# Altium project RTM_SFP.PrjPcb (part 1 of 2)
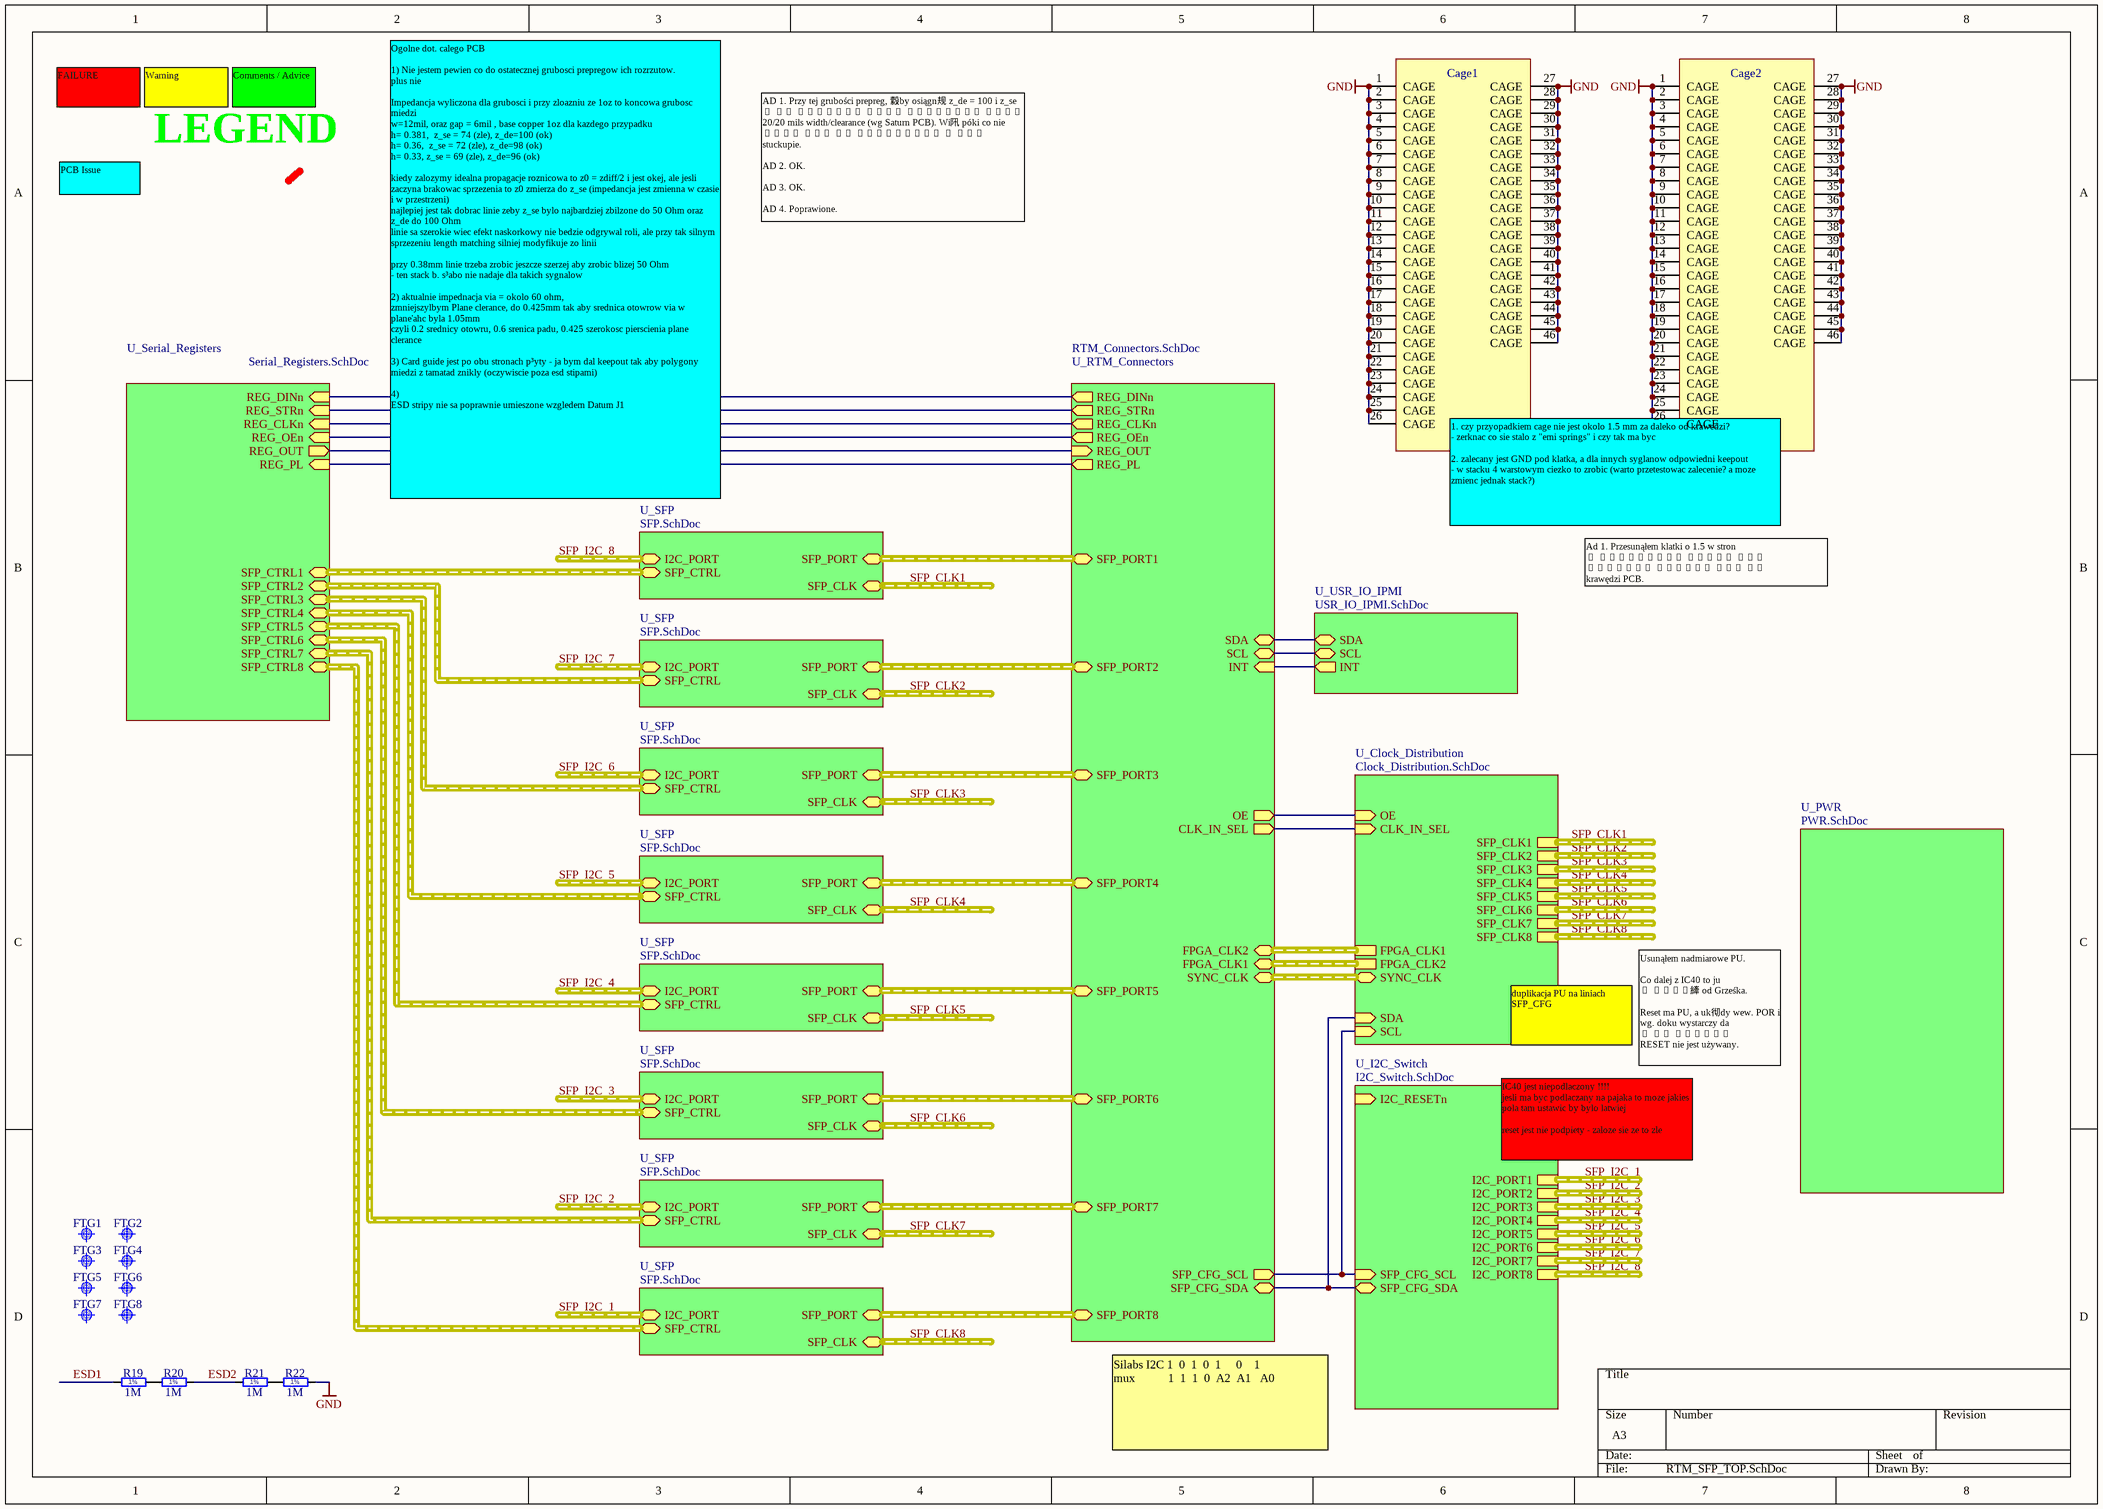
[diagram p0: RTM_SFP_TOP.SchDoc]
8 sheets, 363 parts. Net scope: hierarchical (ports join the sheet entries above them; power ports are global).
Board file: RTM_SFP.PcbDoc
Sheets:
  RTM_SFP_TOP.SchDoc
    U_SFP = SFP.SchDoc
    U_I2C_Switch = I2C_Switch.SchDoc
    U_Clock_Distribution = Clock_Distribution.SchDoc
    U_Serial_Registers = Serial_Registers.SchDoc
    U_SFP = SFP.SchDoc
    U_SFP = SFP.SchDoc
    U_SFP = SFP.SchDoc
    U_SFP = SFP.SchDoc
    U_SFP = SFP.SchDoc
    U_SFP = SFP.SchDoc
    U_SFP = SFP.SchDoc
    U_RTM_Connectors = RTM_Connectors.SchDoc
    U_USR_IO_IPMI = USR_IO_IPMI.SchDoc
    U_PWR = PWR.SchDoc

## Sheet RTM_SFP_TOP.SchDoc
size A3

### Parts
Cage1  SFP+  [TYCO_2007132-1]
Cage2  SFP+  [TYCO_2007132-1]
FTG1  Use only in PCB  [FIDUCIAL_TOP_S100-200]  (value not drawn)
FTG2  Use only in PCB  [FIDUCIAL_TOP_C100-200]  (value not drawn)
FTG3  Use only in PCB  [FIDUCIAL_TOP_S100-200]  (value not drawn)
FTG4  Use only in PCB  [FIDUCIAL_TOP_C100-200]  (value not drawn)
FTG5  Use only in PCB  [FIDUCIAL_TOP_S100-200]  (value not drawn)
FTG6  Use only in PCB  [FIDUCIAL_TOP_C100-200]  (value not drawn)
FTG7  Use only in PCB  [FIDUCIAL_TOP_S100-200]  (value not drawn)
FTG8  Use only in PCB  [FIDUCIAL_TOP_C100-200]  (value not drawn)
R19  1M  [RESC3216X65N]
R20  1M  [RESC3216X65N]
R21  1M  [RESC3216X65N]
R22  1M  [RESC3216X65N]

### Sub-sheets
U_Clock_Distribution = Clock_Distribution.SchDoc: SDA (in), SCL (in), OE (in), CLK_IN_SEL (in), FPGA_CLK1 (harness CLOCK_DIFF), FPGA_CLK2 (harness CLOCK_DIFF), SFP_CLK2 (harness CLOCK_DIFF), SFP_CLK3 (harness CLOCK_DIFF), SFP_CLK4 (harness CLOCK_DIFF), SFP_CLK5 (harness CLOCK_DIFF), SFP_CLK6 (harness CLOCK_DIFF), SFP_CLK7 (harness CLOCK_DIFF), SFP_CLK8 (harness CLOCK_DIFF), SFP_CLK1 (harness CLOCK_DIFF), SYNC_CLK (harness CLOCK_DIFF)
U_I2C_Switch = I2C_Switch.SchDoc: I2C_RESETn (in), I2C_PORT5 (harness I2C), I2C_PORT2 (harness I2C), I2C_PORT1 (harness I2C), I2C_PORT4 (harness I2C), I2C_PORT3 (harness I2C), I2C_PORT7 (harness I2C), I2C_PORT6 (harness I2C), I2C_PORT8 (harness I2C), SFP_CFG_SDA (bidir), SFP_CFG_SCL (in)
U_PWR = PWR.SchDoc: no entries
U_RTM_Connectors = RTM_Connectors.SchDoc: SFP_PORT8 (harness SFP_PORT), SFP_PORT7 (harness SFP_PORT), SFP_PORT6 (harness SFP_PORT), SFP_PORT5 (harness SFP_PORT), SFP_PORT4 (harness SFP_PORT), SFP_PORT3 (harness SFP_PORT), SFP_PORT2 (harness SFP_PORT), SFP_PORT1 (harness SFP_PORT), REG_DINn (out), REG_STRn (out), REG_CLKn (out), REG_OEn (out), REG_OUT (in), SFP_CFG_SDA (bidir), SFP_CFG_SCL (out), SDA (bidir), SCL (bidir), INT (in), FPGA_CLK2 (harness CLOCK_DIFF), FPGA_CLK1 (harness CLOCK_DIFF), SYNC_CLK (harness CLOCK_DIFF), OE (out), CLK_IN_SEL (out), REG_PL (out)
U_Serial_Registers = Serial_Registers.SchDoc: SFP_CTRL1 (harness SFP_CTRL), SFP_CTRL2 (harness SFP_CTRL), SFP_CTRL3 (harness SFP_CTRL), SFP_CTRL4 (harness SFP_CTRL), SFP_CTRL5 (harness SFP_CTRL), SFP_CTRL6 (harness SFP_CTRL), SFP_CTRL7 (harness SFP_CTRL), SFP_CTRL8 (harness SFP_CTRL), REG_DINn (in), REG_STRn (in), REG_CLKn (in), REG_OEn (in), REG_OUT (out), REG_PL (in)
U_SFP = SFP.SchDoc: I2C_PORT (harness I2C), SFP_CLK (harness CLOCK_DIFF), SFP_PORT (harness SFP_PORT), SFP_CTRL (harness SFP_CTRL)
U_SFP = SFP.SchDoc: I2C_PORT (harness I2C), SFP_CLK (harness CLOCK_DIFF), SFP_PORT (harness SFP_PORT), SFP_CTRL (harness SFP_CTRL)
U_SFP = SFP.SchDoc: I2C_PORT (harness I2C), SFP_CLK (harness CLOCK_DIFF), SFP_PORT (harness SFP_PORT), SFP_CTRL (harness SFP_CTRL)
U_SFP = SFP.SchDoc: I2C_PORT (harness I2C), SFP_CLK (harness CLOCK_DIFF), SFP_PORT (harness SFP_PORT), SFP_CTRL (harness SFP_CTRL)
U_SFP = SFP.SchDoc: I2C_PORT (harness I2C), SFP_CLK (harness CLOCK_DIFF), SFP_PORT (harness SFP_PORT), SFP_CTRL (harness SFP_CTRL)
U_SFP = SFP.SchDoc: I2C_PORT (harness I2C), SFP_CLK (harness CLOCK_DIFF), SFP_PORT (harness SFP_PORT), SFP_CTRL (harness SFP_CTRL)
U_SFP = SFP.SchDoc: I2C_PORT (harness I2C), SFP_CLK (harness CLOCK_DIFF), SFP_PORT (harness SFP_PORT), SFP_CTRL (harness SFP_CTRL)
U_SFP = SFP.SchDoc: I2C_PORT (harness I2C), SFP_CLK (harness CLOCK_DIFF), SFP_PORT (harness SFP_PORT), SFP_CTRL (harness SFP_CTRL)
U_USR_IO_IPMI = USR_IO_IPMI.SchDoc: SDA (bidir), SCL (bidir), INT (out)

### Nets
GND: Cage1.1(CAGE) Cage1.2(CAGE) Cage1.3(CAGE) Cage1.4(CAGE) Cage1.5(CAGE) Cage1.6(CAGE) Cage1.7(CAGE) Cage1.8(CAGE) Cage1.9(CAGE) Cage1.10(CAGE) Cage1.11(CAGE) Cage1.12(CAGE) Cage1.13(CAGE) Cage1.14(CAGE) Cage1.15(CAGE) Cage1.16(CAGE) Cage1.17(CAGE) Cage1.18(CAGE) Cage1.19(CAGE) Cage1.20(CAGE) Cage1.21(CAGE) Cage1.22(CAGE) Cage1.23(CAGE) Cage1.24(CAGE) Cage1.25(CAGE) Cage1.26(CAGE) Cage1.27(CAGE) Cage1.28(CAGE) Cage1.29(CAGE) Cage1.30(CAGE) Cage1.31(CAGE) Cage1.32(CAGE) Cage1.33(CAGE) Cage1.34(CAGE) Cage1.35(CAGE) Cage1.36(CAGE) Cage1.37(CAGE) Cage1.38(CAGE) Cage1.39(CAGE) Cage1.40(CAGE) Cage1.41(CAGE) Cage1.42(CAGE) Cage1.43(CAGE) Cage1.44(CAGE) Cage1.45(CAGE) Cage1.46(CAGE) Cage2.1(CAGE) Cage2.2(CAGE) Cage2.3(CAGE) Cage2.4(CAGE) Cage2.5(CAGE) Cage2.6(CAGE) Cage2.7(CAGE) Cage2.8(CAGE) Cage2.9(CAGE) Cage2.10(CAGE) Cage2.11(CAGE) Cage2.12(CAGE) Cage2.13(CAGE) Cage2.14(CAGE) Cage2.15(CAGE) Cage2.16(CAGE) Cage2.17(CAGE) Cage2.18(CAGE) Cage2.19(CAGE) Cage2.20(CAGE) Cage2.21(CAGE) Cage2.22(CAGE) Cage2.23(CAGE) Cage2.24(CAGE) Cage2.25(CAGE) Cage2.26(CAGE) Cage2.27(CAGE) Cage2.28(CAGE) Cage2.29(CAGE) Cage2.30(CAGE) Cage2.31(CAGE) Cage2.32(CAGE) Cage2.33(CAGE) Cage2.34(CAGE) Cage2.35(CAGE) Cage2.36(CAGE) Cage2.37(CAGE) Cage2.38(CAGE) Cage2.39(CAGE) Cage2.40(CAGE) Cage2.41(CAGE) Cage2.42(CAGE) Cage2.43(CAGE) Cage2.44(CAGE) Cage2.45(CAGE) Cage2.46(CAGE) R22.2
ESD1: R19.1
ESD2: R20.2 R21.1
RTM_IO0: sheet U_RTM_Connectors/INT, sheet U_USR_IO_IPMI/INT
RTM_IO1: sheet U_Serial_Registers/REG_OUT, sheet U_RTM_Connectors/REG_OUT
RTM_IO2: sheet U_Serial_Registers/REG_OEn, sheet U_RTM_Connectors/REG_OEn
RTM_IO3: sheet U_Serial_Registers/REG_CLKn, sheet U_RTM_Connectors/REG_CLKn
RTM_IO4: sheet U_Serial_Registers/REG_STRn, sheet U_RTM_Connectors/REG_STRn
RTM_IO5: sheet U_Serial_Registers/REG_DINn, sheet U_RTM_Connectors/REG_DINn
RTM_IO6: sheet U_Serial_Registers/REG_PL, sheet U_RTM_Connectors/REG_PL
RTM_IO8: sheet U_Clock_Distribution/CLK_IN_SEL, sheet U_RTM_Connectors/CLK_IN_SEL
RTM_IO9: sheet U_Clock_Distribution/OE, sheet U_RTM_Connectors/OE
RTM_IO10: sheet U_I2C_Switch/SFP_CFG_SCL, sheet U_Clock_Distribution/SCL, sheet U_RTM_Connectors/SFP_CFG_SCL
RTM_IO11: sheet U_I2C_Switch/SFP_CFG_SDA, sheet U_Clock_Distribution/SDA, sheet U_RTM_Connectors/SFP_CFG_SDA
NetIC12_1: sheet U_RTM_Connectors/SDA, sheet U_USR_IO_IPMI/SDA
NetIC12_2: sheet U_RTM_Connectors/SCL, sheet U_USR_IO_IPMI/SCL
NetR19_2: R19.2 R20.1
NetR21_2: R21.2 R22.1

### Buses and harness runs
harness SFP_CLK1 = sheet U_Clock_Distribution/SFP_CLK1
harness SFP_CLK1 = sheet U_SFP/SFP_CLK
harness SFP_CLK2 = sheet U_Clock_Distribution/SFP_CLK2
harness SFP_CLK2 = sheet U_SFP/SFP_CLK
harness SFP_CLK3 = sheet U_Clock_Distribution/SFP_CLK3
harness SFP_CLK3 = sheet U_SFP/SFP_CLK
harness SFP_CLK4 = sheet U_Clock_Distribution/SFP_CLK4
harness SFP_CLK4 = sheet U_SFP/SFP_CLK
harness SFP_CLK5 = sheet U_Clock_Distribution/SFP_CLK5
harness SFP_CLK5 = sheet U_SFP/SFP_CLK
harness SFP_CLK6 = sheet U_Clock_Distribution/SFP_CLK6
harness SFP_CLK6 = sheet U_SFP/SFP_CLK
harness SFP_CLK7 = sheet U_Clock_Distribution/SFP_CLK7
harness SFP_CLK7 = sheet U_SFP/SFP_CLK
harness SFP_CLK8 = sheet U_Clock_Distribution/SFP_CLK8
harness SFP_CLK8 = sheet U_SFP/SFP_CLK
harness SFP_I2C_1 = sheet U_I2C_Switch/I2C_PORT1
harness SFP_I2C_1 = sheet U_SFP/I2C_PORT
harness SFP_I2C_2 = sheet U_I2C_Switch/I2C_PORT2
harness SFP_I2C_2 = sheet U_SFP/I2C_PORT
harness SFP_I2C_3 = sheet U_I2C_Switch/I2C_PORT3
harness SFP_I2C_3 = sheet U_SFP/I2C_PORT
harness SFP_I2C_4 = sheet U_I2C_Switch/I2C_PORT4
harness SFP_I2C_4 = sheet U_SFP/I2C_PORT
harness SFP_I2C_5 = sheet U_I2C_Switch/I2C_PORT5
harness SFP_I2C_5 = sheet U_SFP/I2C_PORT
harness SFP_I2C_6 = sheet U_I2C_Switch/I2C_PORT6
harness SFP_I2C_6 = sheet U_SFP/I2C_PORT
harness SFP_I2C_7 = sheet U_I2C_Switch/I2C_PORT7
harness SFP_I2C_7 = sheet U_SFP/I2C_PORT
harness SFP_I2C_8 = sheet U_I2C_Switch/I2C_PORT8
harness SFP_I2C_8 = sheet U_SFP/I2C_PORT
harness sheet U_Clock_Distribution/FPGA_CLK1 = sheet U_RTM_Connectors/FPGA_CLK2
harness sheet U_Clock_Distribution/FPGA_CLK2 = sheet U_RTM_Connectors/FPGA_CLK1
harness sheet U_Clock_Distribution/SYNC_CLK = sheet U_RTM_Connectors/SYNC_CLK
harness sheet U_RTM_Connectors/SFP_PORT1 = sheet U_SFP/SFP_PORT
harness sheet U_RTM_Connectors/SFP_PORT2 = sheet U_SFP/SFP_PORT
harness sheet U_RTM_Connectors/SFP_PORT3 = sheet U_SFP/SFP_PORT
harness sheet U_RTM_Connectors/SFP_PORT4 = sheet U_SFP/SFP_PORT
harness sheet U_RTM_Connectors/SFP_PORT5 = sheet U_SFP/SFP_PORT
harness sheet U_RTM_Connectors/SFP_PORT6 = sheet U_SFP/SFP_PORT
harness sheet U_RTM_Connectors/SFP_PORT7 = sheet U_SFP/SFP_PORT
harness sheet U_RTM_Connectors/SFP_PORT8 = sheet U_SFP/SFP_PORT
harness sheet U_Serial_Registers/SFP_CTRL1 = sheet U_SFP/SFP_CTRL
harness sheet U_Serial_Registers/SFP_CTRL2 = sheet U_SFP/SFP_CTRL
harness sheet U_Serial_Registers/SFP_CTRL3 = sheet U_SFP/SFP_CTRL
harness sheet U_Serial_Registers/SFP_CTRL4 = sheet U_SFP/SFP_CTRL
harness sheet U_Serial_Registers/SFP_CTRL5 = sheet U_SFP/SFP_CTRL
harness sheet U_Serial_Registers/SFP_CTRL6 = sheet U_SFP/SFP_CTRL
harness sheet U_Serial_Registers/SFP_CTRL7 = sheet U_SFP/SFP_CTRL
harness sheet U_Serial_Registers/SFP_CTRL8 = sheet U_SFP/SFP_CTRL

### Notes on the sheet
- FAILURE
- Warning
- Comments / Advice
- PCB Issue
- AD 1. Przy tej grubości prepreg, 縠by osi筭n规 z_de = 100 i z_se = 50 routing diff musiałby mie� 20/20 mils width/clearance (wg Saturn PCB). Wi阠 póki co nie wiem jak to rozwi箊a� w tym stuckupie.
  AD 2. OK.
  AD 3. OK.
  AD 4. Poprawione.
- Ogolne dot. calego PCB
  1) Nie jestem pewien co do ostatecznej grubosci prepregow ich rozrzutow.
  plus nie
  Impedancja wyliczona dla grubosci i przy zloazniu ze 1oz to koncowa grubosc miedzi
  w=12mil, oraz gap = 6mil , base copper 1oz dla kazdego przypadku
  h= 0.381,  z_se = 74 (zle), z_de=100 (ok)
  h= 0.36,  z_se = 72 (zle), z_de=98 (ok)
  h= 0.33, z_se = 69 (zle), z_de=96 (ok)
  kiedy zalozymy idealna propagacje roznicowa to z0 = zdiff/2 i jest okej, ale jesli zaczyna brakowac sprzezenia to z0 zmierza do z_se (impedancja jest zmienna w czasie i w przestrzeni)
  najlepiej jest tak dobrac linie zeby z_se bylo najbardziej zbilzone do 50 Ohm oraz z_de do 100 Ohm
  linie sa szerokie wiec efekt naskorkowy nie bedzie odgrywal roli, ale przy tak silnym sprzezeniu length matching silniej modyfikuje zo linii
  przy 0.38mm linie trzeba zrobic jeszcze szerzej aby zrobic blizej 50 Ohm
  - ten stack b. s³abo nie nadaje dla takich sygnalow
  2) aktualnie impednacja via = okolo 60 ohm,
  zmniejszylbym Plane clerance, do 0.425mm tak aby srednica otowrow via w plane'ahc byla 1.05mm
  czyli 0.2 srednicy otowru, 0.6 srenica padu, 0.425 szerokosc pierscienia plane clerance
  3) Card guide jest po obu stronach p³yty - ja bym dal keepout tak aby polygony miedzi z tamatad znikly (oczywiscie poza esd stipami)
  4)
  ESD stripy nie sa poprawnie umieszone wzgledem Datum J1
- 1. czy przyopadkiem cage nie jest okolo 1.5 mm za daleko od krawedzi?
  - zerknac co sie stalo z "emi springs" i czy tak ma byc
  2. zalecany jest GND pod klatka, a dla innych syglanow odpowiedni keepout
  - w stacku 4 warstowym ciezko to zrobic (warto przetestowac zalecenie? a moze zmienc jednak stack?)
- Ad 1. Przesunąłem klatki o 1.5 w stron� krawędzi. Teraz emi springs ko馽z� si� na krawędzi PCB.
- duplikacja PU na liniach SFP_CFG
- Usunąłem nadmiarowe PU.
  Co dalej z IC40 to ju� zale縴 od Grześka.
  Reset ma PU, a uk彻dy wew. POR i wg. doku wystarczy da� PU jeżeli RESET nie jest używany.
- IC40 jest niepodlaczony !!!!
  jesli ma byc podlaczany na pajaka to moze jakies pola tam ustawic by bylo latwiej
  reset jest nie podpiety - zaloze sie ze to zle
- Silabs I2C 1  0  1  0  1     0    1
  mux           1  1  1  0  A2  A1   A0
- Labels drawn without touching a wire or pin: LEGEND
- (in symbol R1206_1M_1%_0.25W_100PPM) 1%

### Library data of the parts
Cage1 Cage2 = TYCO_2007132-1: SFP+  1x4 Cage (46 Pins); Part Description: 1x4 Press Fit Cage For Use with SFP+ Connector (Small Form-factor Pluggable); Manufacturer: TYCO ELECTRONICS; Table: TYCO; Part Number: TYCO_2007132-1; Component Kind: Standard; Component Type: Standard; Pin Count: 46; Family: SFP+; Mounted: Yes; Socket: No; SMD: No; Status: None; Manufacturer Part Number: 2007132-1; ComponentHeight: 9.7mm; HelpURL: \\cern.ch\dfs\Applications\Altium\Datasheets\TYCO_2007132-1.pdf; Author: CERN DEM JLC; CreateDate: 2013-06-04; LatestRevisionDate: 2013-06-12
FTG1 FTG3 FTG5 FTG7 = FIDUCIAL_TARGET_S100-200: Fiducial Target; Part Description: Square Fiducial Target, Top Layer, 1.0mm, Top Solder 2.0mm, Keepout =2.0mm; Mounted: No; Table: Pads; Part Number: FIDUCIAL_TARGET_S100-200; Component Kind: Standard (No BOM); Component Type: Standard (No BOM); Pin Count: 1; Family: Fiducial; Socket: No; SMD: Yes; Status: None; ComponentHeight: 0mm; Author: CERN DEM JLC; CreateDate: 2010-02-09; LatestRevisionDate: 2012-04-04; PackageDescription: Square Fiducial Target, Top Layer, 1.0mm, Top Solder 2.0mm, Keepout =2.0mm
FTG2 FTG4 FTG6 FTG8 = FIDUCIAL_TARGET_C100-200: Fiducial Target; Part Description: Round Fiducial Target, Top Layer, 1.0mm, Top Solder 2.0mm, Keepout =2.0mm; Mounted: No; Table: Pads; Part Number: FIDUCIAL_TARGET_C100-200; Component Kind: Standard (No BOM); Component Type: Standard (No BOM); Pin Count: 1; Family: Fiducial; Socket: No; SMD: Yes; Status: None; ComponentHeight: 0mm; Author: CERN DEM JLC; CreateDate: 2010-02-09; LatestRevisionDate: 2012-04-04; PackageDescription: Round Fiducial Target, Top Layer, 1.0mm, Top Solder 2.0mm, Keepout =2.0mm
R19-R22 = R1206_1M_1%_0.25W_100PPM: Resistor - 1%; Part Description: General Purpose Thick Film Chip Resistor; Manufacturer: GENERIC; Manufacturer1 Part Number: NRC12F1004TRF; Power: 0.25W; TC: ±100ppm/°C; Table: Resistors SMD; Part Number: R1206_1M_1%_0.25W_100PPM; Component Kind: Standard; Component Type: Standard; Pin Count: 2; Value: 1M; Status: Preferred; Tolerance: ±1%; Manufacturer Part Number: R1206_1M_1%_0.25W_100PPM; Case: 1206; Mounted: Yes; Socket: No; SMD: Yes; Manufacturer1 Example: NIC COMPONENT; Manufacturer1 ComponentHeight: 0.65mm; HelpURL: \\cern.ch\dfs\Applications\Altium\Datasheets\R1206_NIC_NRC.pdf; Author: CERN DEM JLC; CreateDate: 2007-12-03; LatestRevisionDate: 2008-03-13

## Sheet SFP.SchDoc
size A4; Organization: Altium Limited; Address1: L3, 12a Rodborough Rd; Address2: Frenchs Forest; Address3: NSW; Address4: Australia 2086
Used 8 times, as channels U_SFP, U_SFP, U_SFP, U_SFP, U_SFP, U_SFP, U_SFP, U_SFP. Parts and nets are listed once, with the designators drawn on the sheet.
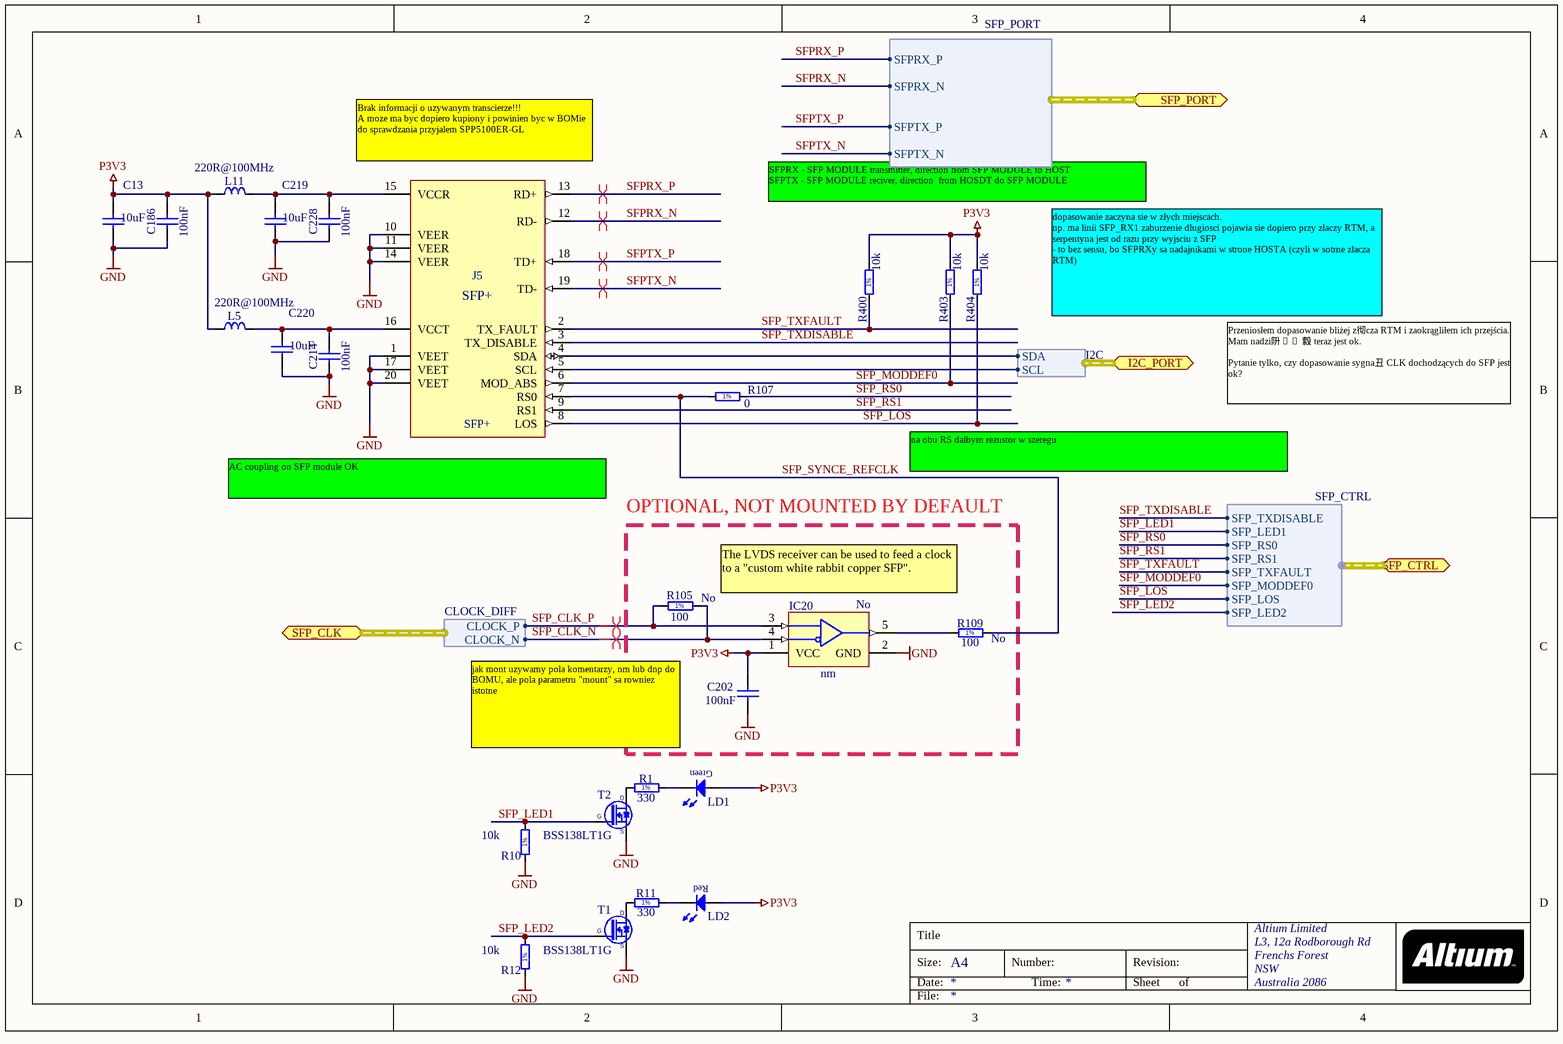
[diagram p1: SFP.SchDoc]

### Parts
C13  10uF  [CAPC2012X135N]
C186  100nF  [CAPC1005X55N]
C202  100nF  [CAPC1005X55N]
C214  100nF  [CAPC1005X55N]
C219  10uF  [CAPC2012X135N]
C220  10uF  [CAPC2012X135N]
C228  100nF  [CAPC1005X55N]
IC20  nm  Mounted: No  [SOT95P280X145-5N]
J5  SFP+  [TYCO_1888247-1]
L5  220R@100MHz  [INDC2012X105N]
L11  220R@100MHz  [INDC2012X105N]
LD1  Green  [LED_AVAGO_HSME-C120]  (value not drawn)
LD2  Red  [LED_AVAGO_HSME-C120]  (value not drawn)
R1  330  [RESC1608X55N]
R10  10k  [RESC1608X55N]
R11  330  [RESC1608X55N]
R12  10k  [RESC1608X55N]
R105  100  Mounted: No  [RESC1608X55N]
R107  0  [RESC1608X55N]
R109  100  Mounted: No  [RESC1608X55N]
R400  10k  [RESC1608X55N]
R403  10k  [RESC1608X55N]
R404  10k  [RESC1608X55N]
T1  BSS138LT1G  [SOT95P240X110-3N]
T2  BSS138LT1G  [SOT95P240X110-3N]

### Blocks framed on the sheet
OPTIONAL, NOT MOUNTED BY DEFAULT: C202 IC20 R105 R109

### Ports
I2C_PORT (harness I2C), SFP_CLK (harness CLOCK_DIFF), SFP_CTRL (harness SFP_CTRL), SFP_PORT (harness SFP_PORT)

### Harnesses
I2C: SCL, SDA
CLOCK_DIFF: CLOCK_P, CLOCK_N
SFP_PORT: SFPRX_P, SFPRX_N, SFPTX_P, SFPTX_N
SFP_CTRL: SFP_LED1, SFP_TXFAULT, SFP_TXDISABLE, SFP_MODDEF0, SFP_RS0, SFP_RS1, SFP_LOS, SFP_LED2

### Nets
GND: C13.2 C186.2 C202.1 C214.2 C219.2 C220.2 C228.2 IC20.2(GND) J5.1(VEET) J5.10(VEER) J5.11(VEER) J5.14(VEER) J5.17(VEET) J5.20(VEET) R10.1 R12.1 T1.2(S) T2.2(S)
P3V3: C13.1 C186.1 C202.2 IC20.1(VCC) L5.1 L11.1 LD1.1(A) LD2.1(A) R400.2 R403.2 R404.2
SFP_CLK_N: IC20.4(B) R105.2 ; port SFP_CLK.CLOCK_N
SFP_CLK_P: IC20.3(A) R105.1 ; port SFP_CLK.CLOCK_P
SFP_LED1: R10.2 T2.1(G) ; port SFP_CTRL.SFP_LED1
SFP_LED2: R12.2 T1.1(G) ; port SFP_CTRL.SFP_LED2
SFP_LOS: J5.8(LOS) R404.1 ; port SFP_CTRL.SFP_LOS
SFP_MODDEF0: J5.6(MOD_ABS) R403.1 ; port SFP_CTRL.SFP_MODDEF0
SFP_RS0: R107.2 ; port SFP_CTRL.SFP_RS0
SFP_RS1: J5.9(RS1) ; port SFP_CTRL.SFP_RS1
SFP_SYNCE_REFCLK: J5.7(RS0) R107.1 R109.2
SFP_TXDISABLE: J5.3(TX_DISABLE) ; port SFP_CTRL.SFP_TXDISABLE
SFP_TXFAULT: J5.2(TX_FAULT) R400.1 ; port SFP_CTRL.SFP_TXFAULT
SFPRX_N: J5.12(RD-) ; port SFP_PORT.SFPRX_N
SFPRX_P: J5.13(RD+) ; port SFP_PORT.SFPRX_P
SFPTX_N: J5.19(TD-) ; port SFP_PORT.SFPTX_N
SFPTX_P: J5.18(TD+) ; port SFP_PORT.SFPTX_P
NetC214_1: C214.1 C220.1 J5.16(VCCT) L5.2
NetC219_1: C219.1 C228.1 J5.15(VCCR) L11.2
NetIC20_5: IC20.5(R) R109.1
NetJ5_4: J5.4(SDA) ; port I2C_PORT.SDA
NetJ5_5: J5.5(SCL) ; port I2C_PORT.SCL
NetLD1_2: LD1.2(C) R1.2
NetLD2_2: LD2.2(C) R11.2
NetR1_1: R1.1 T2.3(D)
NetR11_1: R11.1 T1.3(D)

### Channels
U_SFP: designators end in A
U_SFP: designators end in B
U_SFP: designators end in C
U_SFP: designators end in D
U_SFP: designators end in E
U_SFP: designators end in F
U_SFP: designators end in G
U_SFP: designators end in H

### Layout directives
differential pair: SFP1RX_N, SFP1RX_P, SFP1TX_N, SFP1TX_P, SFP_CLK1.CLOCK_N, SFP_CLK1.CLOCK_P

### Notes on the sheet
- (near J5) Brak informacji o uzywanym transcierze!!!
  A moze ma byc dopiero kupiony i powinien byc w BOMie
  do sprawdzania przyjalem SPP5100ER-GL
- SFPRX - SFP MODULE transmitter, direction from SFP MODULE to HOST
  SFPTX - SFP MODULE reciver, direction  from HOSDT do SFP MODULE
- dopasowanie zaczyna sie w zlych miejscach.
  np. ma linii SFP_RX1 zaburzenie dlugiosci pojawia sie dopiero przy zlaczy RTM, a serpentyna jest od razu przy wyjsciu z SFP
  - to bez sensu, bo SFPRXy sa nadajnikami w strone HOSTA (czyli w sotrne zlacza RTM)
- Przeniosłem dopasowanie bliżej z彻cza RTM i zaokrągliłem ich przejścia. Mam nadzi阩�, 縠 teraz jest ok.
  Pytanie tylko, czy dopasowanie sygna丑 CLK dochodzących do SFP jest ok?
- (near J5) AC coupling on SFP module OK
- na obu RS dalbym rezustor w szeregu
- The LVDS receiver can be used to feed a clock to a "custom white rabbit copper SFP".
- jak mont uzywamy pola komentarzy, nm lub dnp do BOMU, ale pola parametru "mount" sa rowniez istotne
- Title
- Size:
- Date:
- A4
- Number:
- Time:
- Revision:
- Sheet
- of
- File:
- (in symbol R0603_0R_JUMPER) 1%
- (in symbol R0603_10K_1%_0.1W_100PPM) 1%
- (in symbol R0603_100R_1%_0.1W_100PPM) 1%
- (in symbol R0603_330R_1%_0.1W_100PPM) 1%

### Library data of the parts
C13 C219 C220 = CC0805_10UF_10V_10%_X7R: Non-polarised capacitor; Part Description: SMD Multilayer Chip Ceramic Capacitor; Manufacturer: GENERIC; Manufacturer1 Part Number: GRM21BR71A106KE51L; Voltage: 10V; TC: X7R; Tolerance: ±10%; Table: Capacitors SMD; Part Number: CC0805_10UF_10V_10%_X7R; Component Kind: Standard; Component Type: Standard; Pin Count: 2; Value: 10uF; Status: Preferred; Manufacturer Part Number: CC0805_10UF_10V_10%_X7R; Case: 0805; Mounted: Yes; Socket: No; SMD: Yes; Manufacturer1 Example: MURATA; Manufacturer1 ComponentHeight: 1.35mm; HelpURL: \\cern.ch\dfs\Applications\Altium\Datasheets\CC0805_X7R_MURATA.pdf; Author: CERN DEM JLC; CreateDate: 2012-04-30; LatestRevisionDate: 2012-04-30
C186 C214 C228 = CC0402_100NF_16V_10%_X7R: Non-polarised capacitor; Part Description: SMD Multilayer Chip Ceramic Capacitor; Manufacturer: GENERIC; Manufacturer1 Part Number: 223878715649; Voltage: 16V; TC: X7R; Tolerance: ±10%; Table: Capacitors SMD; Part Number: CC0402_100NF_16V_10%_X7R; Component Kind: Standard; Component Type: Standard; Pin Count: 2; Value: 100nF; Status: Not Recommended; Manufacturer Part Number: CC0402_100NF_16V_10%_X7R; Case: 0402; Mounted: Yes; Socket: No; SMD: Yes; Manufacturer1 Example: PHYCOMP; Manufacturer1 ComponentHeight: 0.55mm; HelpURL: \\cern.ch\dfs\Applications\Altium\Datasheets\CC0402_X7R_PHYCOMP.pdf; Author: CERN DEM JLC; CreateDate: 12/3/2007; LatestRevisionDate: 12/3/2007
C202 = CC0402_100NF_16V_10%_X7R: Non-polarised capacitor; Part Description: SMD Multilayer Chip Ceramic Capacitor; Manufacturer: GENERIC; Manufacturer1 Part Number: 223878715649; Voltage: 16V; TC: X7R; Tolerance: ±10%; Mounted: No; Table: Capacitors SMD; Part Number: CC0402_100NF_16V_10%_X7R; Component Kind: Standard; Component Type: Standard; Pin Count: 2; Value: 100nF; Status: Not Recommended; Manufacturer Part Number: CC0402_100NF_16V_10%_X7R; Case: 0402; Socket: No; SMD: Yes; Manufacturer1 Example: PHYCOMP; Manufacturer1 ComponentHeight: 0.55mm; HelpURL: \\cern.ch\dfs\Applications\Altium\Datasheets\CC0402_X7R_PHYCOMP.pdf; Author: CERN DEM JLC; CreateDate: 2007-12-03; LatestRevisionDate: 2007-12-03
IC20 = SN65LVDS2DBVR: High-Speed Differential Line Receiver; Manufacturer: TEXAS INSTRUMENTS; Table: Analog & Interface; Part Number: SN65LVDS2DBVR; Component Kind: Standard; Component Type: Standard; Device: SN65LVDS2DBVR; PackageDescription: SOT, 0.95mm pitch; 5 pin, 1.60mm W X 2.90mm L X 1.45mm H body, IPC Medium Density; Part Description: High-Speed Differential Line Receiver; Manufacturer Part Number: SN65LVDS2DBVR; Pin Count: 5; Case: SOT23-5; Socket: No; SMD: Yes; ComponentHeight: 1.45mm; Author: CERN DEM JLC; HelpURL: \\cern.ch\dfs\Applications\Altium\Datasheets\SN65LVDS2DBVR.pdf; CreateDate: 3/3/2011; LatestRevisionDate: 3/3/2011
J5 = TYCO_1888247-1: 20 Position SFP+ Connector (Small Form-factor Pluggable); Part Description: 20 Position, Pitch 0.8mm SFP+  Receptacle (Small Form-factor Pluggable); Manufacturer: TYCO ELECTRONICS; Table: TYCO; Part Number: TYCO_1888247-1; Component Kind: Standard; Component Type: Standard; Pin Count: 20; Family: SFP+; Mounted: Yes; Socket: No; SMD: Yes; Status: None; Manufacturer Part Number: 1888247-1; ComponentHeight: 5.4mm; HelpURL: \\cern.ch\dfs\Applications\Altium\Datasheets\TYCO_1888247-1.pdf; Author: CERN DEM JLC; CreateDate: 2012-02-27; LatestRevisionDate: 2012-02-27
L5 L11 = IND0805_MURATA_BLM21PG221SN1D: Inductor; Part Description: SMD EMIFIL Suppression Chip Ferrite Bead; Manufacturer: MURATA; Power: 2A; Resistance: 0.05R; Tolerance: ±25%; Table: Inductors SMD; Part Number: IND0805_MURATA_BLM21PG221SN1D; Component Kind: Standard; Component Type: Standard; Pin Count: 2; Value: 220R@100MHz; Status: None; Manufacturer Part Number: BLM21PG221SN1D; Case: 0805; Mounted: Yes; Socket: No; SMD: Yes; ComponentHeight: 1.05mm; HelpURL: \\cern.ch\dfs\Applications\Altium\Datasheets\IND0402_MURATA_BLM21P.pdf; Author: CERN DEM JLC; CreateDate: 25/01/2010; LatestRevisionDate: 25/01/2010
LD1 = LED_SMD_90deg_mini_G: LED Green Avago C120; Part Description: High Performance Right Angle Chip Green LED; Manufacturer: AVAGO TECHNOLOGIES; Manufacturer Part Number: HSME-C120; Table: LEDs & Displays; Part Number: LED_AVAGO_HSME-C120; Component Kind: Standard; Component Type: Standard; Color: Green; PackageDescription: Green Chip LED, 2-Leads, Body 1.7x1.1mm, Side Emitting Package; Pin Count: 2; Mounted: Yes; Socket: No; SMD: Yes; ComponentHeight: 0.7mm; HelpURL: \\cern.ch\dfs\Applications\Altium\Datasheets\LED_AVAGO_HSME-C120.pdf; ComponentLink1URL: \\cern.ch\dfs\Applications\Altium\Datasheets\LED_AVAGO_HSME-C110_DESIGN-GUIDE.pdf; ComponentLink1Description: Design Guide; Author: CERN DEM JMW; CreateDate: 2009-07-22; LatestRevisionDate: 2012-06-20
LD2 = LED_SMD_90deg_mini_R: LED Red Avago C120; Part Number: LED_AVAGO_HSMC-C120; Part Description: High Performance Right Angle Chip Red LED; Manufacturer: AVAGO TECHNOLOGIES; Manufacturer Part Number: HSMC-C120; Table: LEDs & Displays; Component Kind: Standard; Component Type: Standard; Color: Red; Footprint: LED_AVAGO_HSMC-C120; PackageDescription: Red Chip LED, 2-Leads, Body 1.7x1.1mm, Side Emitting Package; Pin Count: 2; Mounted: Yes; Socket: No; SMD: Yes; ComponentHeight: 0.7mm; HelpURL: \\cern.ch\dfs\Applications\Altium\Datasheets\LED_AVAGO_HSME-C120.pdf; ComponentLink1URL: \\cern.ch\dfs\Applications\Altium\Datasheets\LED_AVAGO_HSME-C110_DESIGN-GUIDE.pdf; ComponentLink1Description: Design Guide; Author: CERN DEM JMW; CreateDate: 2009-07-22; LatestRevisionDate: 2012-06-20
R1 R11 = R0603_330R_1%_0.1W_100PPM: Resistor - 1%; Part Description: General Purpose Thick Film Chip Resistor; Manufacturer: GENERIC; Manufacturer1 Part Number: NRC06F3300TRF; Power: 0.1W; TC: ±100ppm/°C; Table: Resistors SMD; Part Number: R0603_330R_1%_0.1W_100PPM; Component Kind: Standard; Component Type: Standard; Pin Count: 2; Value: 330; Status: Preferred; Tolerance: ±1%; Manufacturer Part Number: R0603_330R_1%_0.1W_100PPM; Case: 0603; Mounted: Yes; Socket: No; SMD: Yes; Manufacturer1 Example: NIC COMPONENT; Manufacturer1 ComponentHeight: 0.55mm; HelpURL: \\cern.ch\dfs\Applications\Altium\Datasheets\R0603_NIC_NRC.pdf; Author: CERN DEM JLC; CreateDate: 2007-12-03; LatestRevisionDate: 2008-03-13
R10 R12 R400 R403 R404 = R0603_10K_1%_0.1W_100PPM: Resistor - 1%; Part Description: General Purpose Thick Film Chip Resistor; Manufacturer: GENERIC; Manufacturer1 Part Number: NRC06F1002TRF; Power: 0.1W; TC: ±100ppm/°C; Table: Resistors SMD; Part Number: R0603_10K_1%_0.1W_100PPM; Component Kind: Standard; Component Type: Standard; Pin Count: 2; Value: 10k; Status: Preferred; Tolerance: ±1%; Manufacturer Part Number: R0603_10K_1%_0.1W_100PPM; Case: 0603; Mounted: Yes; Socket: No; SMD: Yes; Manufacturer1 Example: NIC COMPONENT; Manufacturer1 ComponentHeight: 0.55mm; HelpURL: \\cern.ch\dfs\Applications\Altium\Datasheets\R0603_NIC_NRC.pdf; Author: CERN DEM JLC; CreateDate: 12/3/2007; LatestRevisionDate: 3/13/2008
R105 R109 = R0603_100R_1%_0.1W_100PPM: Resistor - 1%; Part Description: General Purpose Thick Film Chip Resistor; Manufacturer: GENERIC; Manufacturer1 Part Number: NRC06F4700TRF; Power: 0.1W; TC: ±100ppm/°C; Table: Resistors SMD; Part Number: R0603_100R_1%_0.1W_100PPM; Component Kind: Standard; Component Type: Standard; Pin Count: 2; Value: 100; Status: Preferred; Tolerance: ±1%; Manufacturer Part Number: R0603_100R_1%_0.1W_100PPM; Case: 0603; Socket: No; SMD: Yes; Manufacturer1 Example: NIC COMPONENT; Manufacturer1 ComponentHeight: 0.55mm; HelpURL: \\cern.ch\dfs\Applications\Altium\Datasheets\R0603_NIC_NRC.pdf; Author: CERN DEM JLC; CreateDate: 12/3/2007; LatestRevisionDate: 3/13/2008
R107 = R0603_0R_JUMPER: Resistor - 1%; Part Description: 1A (0.05R Max DC Resistance) Zero Ohm Jumper; Manufacturer: GENERIC; Manufacturer1 Part Number: NRC06Z0; Table: Resistors SMD; Part Number: R0603_0R_JUMPER; Component Kind: Standard; Component Type: Standard; Pin Count: 2; Value: 0; Status: Preferred; Manufacturer Part Number: R0603_0R_JUMPER; Case: 0603; Mounted: Yes; Socket: No; SMD: Yes; Manufacturer1 Example: NIC COMPONENT; Manufacturer1 ComponentHeight: 0.55mm; HelpURL: \\cern.ch\dfs\Applications\Altium\Datasheets\R0603_NIC_NRC.pdf; Author: CERN DEM JLC; CreateDate: 12/3/2007; LatestRevisionDate: 3/13/2008
T1 T2 = BSS138LT1G: N-CHANNEL MOSFET WITH DIODE; Part Description: 50V 200mA N-Channel Enhancement Mode Field-Effect Transistor; Manufacturer: ON SEMICONDUCTOR; Table: Transistors; Part Number: BSS138LT1G; Component Kind: Standard; Component Type: Standard; Device: BSS138LT1G; PackageDescription: SOT23 3-Leads, Pitch 0.95mm - Body 1.4x3mm, IPC Medium Density; Manufacturer Part Number: BSS138LT1G; Pin Count: 3; Case: SOT23-3; Mounted: Yes; Socket: No; SMD: Yes; ComponentHeight: 1.11mm; HelpURL: \\cern.ch\dfs\Applications\Altium\Datasheets\BSS138LT1G.pdf; Author: CERN DEM JLC; CreateDate: 2009-03-23; LatestRevisionDate: 2009-03-23

## Sheet I2C_Switch.SchDoc
size A3; Organization: Altium Limited; Address1: L3, 12a Rodborough Rd; Address2: Frenchs Forest; Address3: NSW; Address4: Australia 2086
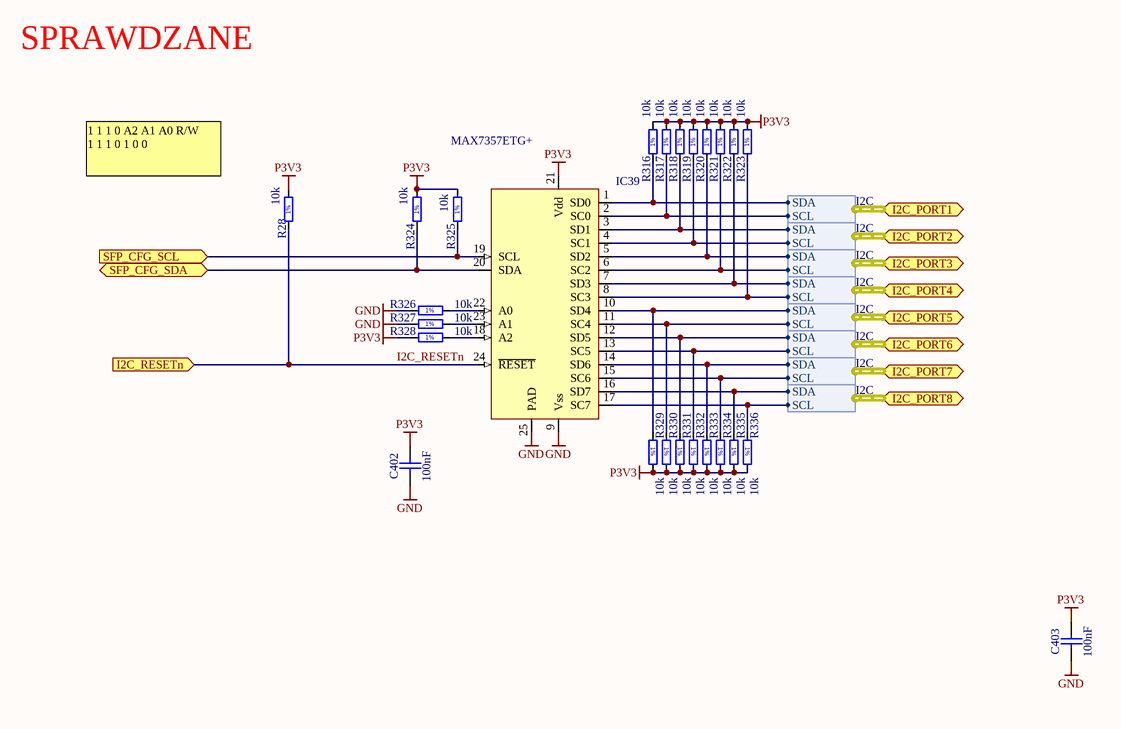
[diagram p2: I2C_Switch.SchDoc]

### Parts
C402  100nF  [CAPC0603X33N]
C403  100nF  [CAPC0603X33N]
IC39  MAX7357ETG+  [HVQFN24]
R28  10k  [RESC1005X40N]
R316  10k  [RESC1005X40N]
R317  10k  [RESC1005X40N]
R318  10k  [RESC1005X40N]
R319  10k  [RESC1005X40N]
R320  10k  [RESC1005X40N]
R321  10k  [RESC1005X40N]
R322  10k  [RESC1005X40N]
R323  10k  [RESC1005X40N]
R324  10k  [RESC1005X40N]
R325  10k  [RESC1005X40N]
R326  10k  [RESC1005X40N]
R327  10k  [RESC1005X40N]
R328  10k  [RESC1005X40N]
R329  10k  [RESC1005X40N]
R330  10k  [RESC1005X40N]
R331  10k  [RESC1005X40N]
R332  10k  [RESC1005X40N]
R333  10k  [RESC1005X40N]
R334  10k  [RESC1005X40N]
R335  10k  [RESC1005X40N]
R336  10k  [RESC1005X40N]

### Ports
I2C_PORT1 (harness I2C), I2C_PORT2 (harness I2C), I2C_PORT3 (harness I2C), I2C_PORT4 (harness I2C), I2C_PORT5 (harness I2C), I2C_PORT6 (harness I2C), I2C_PORT7 (harness I2C), I2C_PORT8 (harness I2C), I2C_RESETn (in), SFP_CFG_SCL (in), SFP_CFG_SDA (bidir)

### Harnesses
I2C: SCL, SDA

### Nets
GND: C402.1 C403.1 IC39.9(Vss) IC39.25(PAD) R326.1 R327.1
P3V3: C402.2 C403.2 IC39.21(Vdd) R28.2 R316.2 R317.2 R318.2 R319.2 R320.2 R321.2 R322.2 R323.2 R324.2 R325.2 R328.1 R329.2 R330.2 R331.2 R332.2 R333.2 R334.2 R335.2 R336.2
I2C_RESETn: IC39.24(~{RESET}) R28.1 ; port I2C_RESETn
RTM_IO10: IC39.19(SCL) R325.1 ; port SFP_CFG_SCL
RTM_IO11: IC39.20(SDA) R324.1 ; port SFP_CFG_SDA
SFP_I2C_1.SCL: IC39.2(SC0) R317.1 ; port I2C_PORT1.SCL
SFP_I2C_1.SDA: IC39.1(SD0) R316.1 ; port I2C_PORT1.SDA
SFP_I2C_2.SCL: IC39.4(SC1) R319.1 ; port I2C_PORT2.SCL
SFP_I2C_2.SDA: IC39.3(SD1) R318.1 ; port I2C_PORT2.SDA
SFP_I2C_3.SCL: IC39.6(SC2) R321.1 ; port I2C_PORT3.SCL
SFP_I2C_3.SDA: IC39.5(SD2) R320.1 ; port I2C_PORT3.SDA
SFP_I2C_4.SCL: IC39.8(SC3) R323.1 ; port I2C_PORT4.SCL
SFP_I2C_4.SDA: IC39.7(SD3) R322.1 ; port I2C_PORT4.SDA
SFP_I2C_5.SCL: IC39.11(SC4) R330.1 ; port I2C_PORT5.SCL
SFP_I2C_5.SDA: IC39.10(SD4) R329.1 ; port I2C_PORT5.SDA
SFP_I2C_6.SCL: IC39.13(SC5) R332.1 ; port I2C_PORT6.SCL
SFP_I2C_6.SDA: IC39.12(SD5) R331.1 ; port I2C_PORT6.SDA
SFP_I2C_7.SCL: IC39.15(SC6) R334.1 ; port I2C_PORT7.SCL
SFP_I2C_7.SDA: IC39.14(SD6) R333.1 ; port I2C_PORT7.SDA
SFP_I2C_8.SCL: IC39.17(SC7) R336.1 ; port I2C_PORT8.SCL
SFP_I2C_8.SDA: IC39.16(SD7) R335.1 ; port I2C_PORT8.SDA
NetIC39_18: IC39.18(A2) R328.2
NetIC39_22: IC39.22(A0) R326.2
NetIC39_23: IC39.23(A1) R327.2

### Notes on the sheet
- SPRAWDZANE
- 1 1 1 0 A2 A1 A0 R/W
  1 1 1 0 1 0 0
- (in symbol R0402_10K_1%_0.0625W_100PPM) 1%

### Library data of the parts
C402 C403 = CC0201_100NF_6.3V_10%_X5R: Non-polarised capacitor; Part Description: SMD Multilayer Chip Ceramic Capacitor; Manufacturer: GENERIC; Manufacturer1 Part Number: 02016D104KAT2A; Voltage: 6.3V; TC: X5R; Tolerance: ±10%; Table: Capacitors SMD; Part Number: CC0201_100NF_6.3V_10%_X5R; Component Kind: Standard; Component Type: Standard; Pin Count: 2; Value: 100nF; Status: Not Recommended; Manufacturer Part Number: CC0201_100NF_6.3V_10%_X5R; Case: 0201; Mounted: Yes; Socket: No; SMD: Yes; Manufacturer1 Example: AVX; Manufacturer1 ComponentHeight: 0.33mm; HelpURL: \\cern.ch\dfs\Applications\Altium\Datasheets\CC0201_X5R_AVX.pdf; Author: CERN DEM JLC; CreateDate: 2007-12-03; LatestRevisionDate: 2007-12-03
IC39 = IIC_MUX_MAX7357ETG+: 8-channel I2C-bus multiplexer with reset, INT and timeout
R28 R316-R336 = R0402_10K_1%_0.0625W_100PPM: Resistor - 1%; Part Description: General Purpose Thick Film Chip Resistor; Manufacturer: GENERIC; Manufacturer1 Part Number: 232270671003L; TC: ±100ppm/°C; Table: Resistors SMD; Part Number: R0402_10K_1%_0.0625W_100PPM; Component Kind: Standard; Component Type: Standard; Pin Count: 2; Value: 10k; Status: Not recommended; Power: 0.0625W; Tolerance: ±1%; Manufacturer Part Number: R0402_10K_1%_0.0625W_100PPM; Case: 0402; Mounted: Yes; Socket: No; SMD: Yes; Manufacturer1 Example: YAGEO PHYCOMP; Manufacturer1 ComponentHeight: 0.4mm; HelpURL: \\cern.ch\dfs\Applications\Altium\Datasheets\R0402_Phycomp_RC0402.pdf; Author: CERN DEM JLC; CreateDate: 2007-12-03; LatestRevisionDate: 2012-10-17

## Sheet Clock_Distribution.SchDoc: Clock Distribution
size 420 x 297 mm; Organization: Altium Limited; Address1: L3, 12a Rodborough Rd; Address2: Frenchs Forest; Address3: NSW; Address4: Australia 2086; SheetNumber: 1; SheetTotal: 8
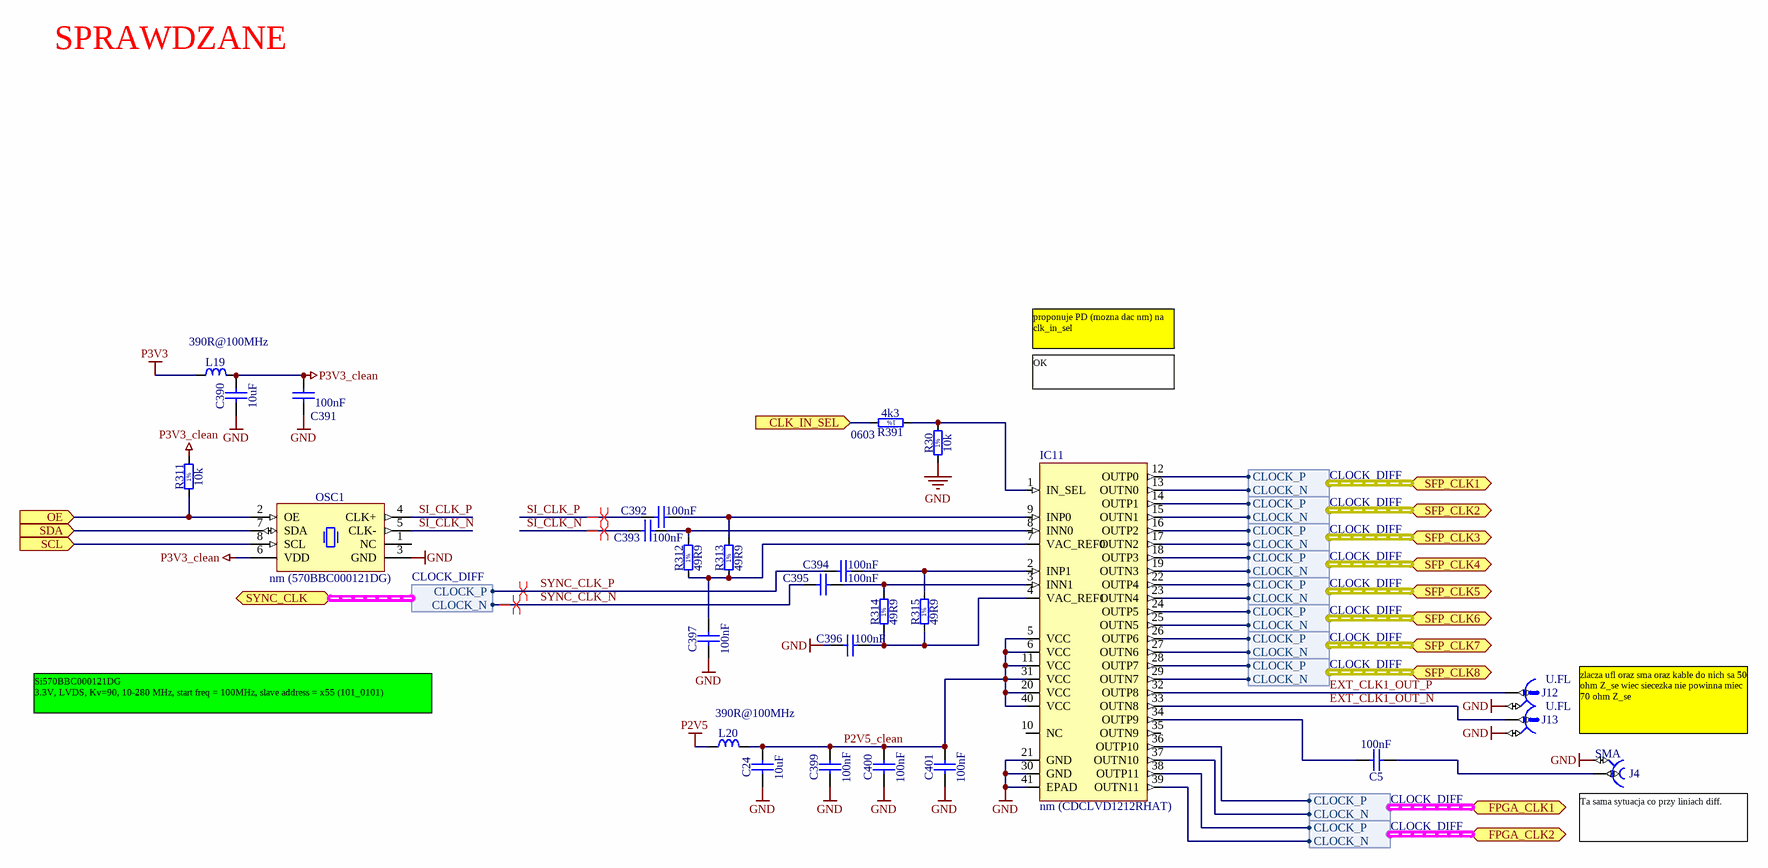
[diagram p3: Clock_Distribution.SchDoc]

### Parts
C5  100nF  [CAPC1005X55N]
C24  10uF  [CAPC2012X135N]
C390  10uF  [CAPC2012X135N]
C391  100nF  [CAPC0603X33N]
C392  100nF  [CAPC0603X33N]
C393  100nF  [CAPC0603X33N]
C394  100nF  [CAPC0603X33N]
C395  100nF  [CAPC0603X33N]
C396  100nF  [CAPC0603X33N]
C397  100nF  [CAPC0603X33N]
C399  100nF  [CAPC0603X33N]
C400  100nF  [CAPC0603X33N]
C401  100nF  [CAPC0603X33N]
IC11  nm (CDCLVD1212RHAT)  [QFN50P600-40]
J4  SMA  [HUBER-SUHNER_85 SMA-50-0-101/111 NE]
J12  U.FL  [HIROSE_U.FL-R-SMT-1(10)]
J13  U.FL  [HIROSE_U.FL-R-SMT-1(10)]
L19  390R@100MHz  [INDC1608X95N]
L20  390R@100MHz  [INDC1608X95N]
OSC1  nm (570BBC000121DG)  [OSC_SILICON-LAB_SI570]
R30  10k  [RESC1005X40N]
R311  10k  [RESC1005X40N]
R312  49R9  [RESC1005X40N]
R313  49R9  [RESC1005X40N]
R314  49R9  [RESC1005X40N]
R315  49R9  [RESC1005X40N]
R391  4k3  Case: 0603  [RESC1608X55N]

### Ports
CLK_IN_SEL (in), FPGA_CLK1 (harness CLOCK_DIFF), FPGA_CLK2 (harness CLOCK_DIFF), OE (in), SCL (in), SDA (in), SFP_CLK1 (harness CLOCK_DIFF), SFP_CLK2 (harness CLOCK_DIFF), SFP_CLK3 (harness CLOCK_DIFF), SFP_CLK4 (harness CLOCK_DIFF), SFP_CLK5 (harness CLOCK_DIFF), SFP_CLK6 (harness CLOCK_DIFF), SFP_CLK7 (harness CLOCK_DIFF), SFP_CLK8 (harness CLOCK_DIFF), SYNC_CLK (harness CLOCK_DIFF)

### Harnesses
CLOCK_DIFF: CLOCK_P, CLOCK_N

### Nets
GND: C24.1 C390.1 C391.1 C396.1 C397.1 C399.1 C400.1 C401.1 IC11.21(GND) IC11.30(GND) IC11.41(EPAD) J4.2 J12.2 J13.2 OSC1.3(GND) R30.1
P2V5: L20.1
P3V3: L19.1
P3V3_clean: C390.2 C391.2 L19.2 OSC1.6(VDD) R311.2
EXT_CLK1_OUT_N: IC11.33(OUTN8) J13.1
EXT_CLK1_OUT_P: IC11.32(OUTP8) J12.1
FPGA_CLK1_N: IC11.39(OUTN11) ; port FPGA_CLK2.CLOCK_N
FPGA_CLK1_P: IC11.38(OUTP11) ; port FPGA_CLK2.CLOCK_P
FPGA_CLK2_N: IC11.37(OUTN10) ; port FPGA_CLK1.CLOCK_N
FPGA_CLK2_P: IC11.36(OUTP10) ; port FPGA_CLK1.CLOCK_P
P2V5_clean: C24.2 C399.2 C400.2 C401.2 IC11.5(VCC) IC11.6(VCC) IC11.11(VCC) IC11.20(VCC) IC11.31(VCC) IC11.40(VCC) L20.2
RTM_IO8: R391.2 ; port CLK_IN_SEL
RTM_IO9: OSC1.2(OE) R311.1 ; port OE
RTM_IO10: OSC1.8(SCL) ; port SCL
RTM_IO11: OSC1.7(SDA) ; port SDA
SFP_CLK1.CLOCK_N: IC11.13(OUTN0) ; port SFP_CLK1.CLOCK_N
SFP_CLK1.CLOCK_P: IC11.12(OUTP0) ; port SFP_CLK1.CLOCK_P
SFP_CLK2.CLOCK_N: IC11.15(OUTN1) ; port SFP_CLK2.CLOCK_N
SFP_CLK2.CLOCK_P: IC11.14(OUTP1) ; port SFP_CLK2.CLOCK_P
SFP_CLK3.CLOCK_N: IC11.17(OUTN2) ; port SFP_CLK3.CLOCK_N
SFP_CLK3.CLOCK_P: IC11.16(OUTP2) ; port SFP_CLK3.CLOCK_P
SFP_CLK4.CLOCK_N: IC11.19(OUTN3) ; port SFP_CLK4.CLOCK_N
SFP_CLK4.CLOCK_P: IC11.18(OUTP3) ; port SFP_CLK4.CLOCK_P
SFP_CLK5.CLOCK_N: IC11.23(OUTN4) ; port SFP_CLK5.CLOCK_N
SFP_CLK5.CLOCK_P: IC11.22(OUTP4) ; port SFP_CLK5.CLOCK_P
SFP_CLK6.CLOCK_N: IC11.25(OUTN5) ; port SFP_CLK6.CLOCK_N
SFP_CLK6.CLOCK_P: IC11.24(OUTP5) ; port SFP_CLK6.CLOCK_P
SFP_CLK7.CLOCK_N: IC11.27(OUTN6) ; port SFP_CLK7.CLOCK_N
SFP_CLK7.CLOCK_P: IC11.26(OUTP6) ; port SFP_CLK7.CLOCK_P
SFP_CLK8.CLOCK_N: IC11.29(OUTN7) ; port SFP_CLK8.CLOCK_N
SFP_CLK8.CLOCK_P: IC11.28(OUTP7) ; port SFP_CLK8.CLOCK_P
SI_CLK_N: C393.2 OSC1.5(CLK-)
SI_CLK_P: C392.2 OSC1.4(CLK+)
SYNC_CLK_N: C395.2 ; port SYNC_CLK.CLOCK_N
SYNC_CLK_P: C394.2 ; port SYNC_CLK.CLOCK_P
NetC5_1: C5.1 IC11.34(OUTP9)
NetC5_2: C5.2 J4.1
NetC392_1: C392.1 IC11.9(INP0) R313.2
NetC393_1: C393.1 IC11.8(INN0) R312.2
NetC394_1: C394.1 IC11.2(INP1) R315.2
NetC395_1: C395.1 IC11.3(INN1) R314.2
NetC396_2: C396.2 IC11.4(VAC_REF1) R314.1 R315.1
NetC397_2: C397.2 IC11.7(VAC_REF0) R312.1 R313.1
NetIC11_1: IC11.1(IN_SEL) R30.2 R391.1

Not connected (* = marked no-connect by the designer): IC11 10(NC) 35(OUTN9); OSC1 1(NC)

### Layout directives
differential pair: SI_CLK_N, SI_CLK_P, SYNC_CLK_N, SYNC_CLK_P

### Notes on the sheet
- SPRAWDZANE
- proponuje PD (mozna dac nm) na clk_in_sel
- OK
- Si570BBC000121DG
  3.3V, LVDS, Kv=90, 10-280 MHz, start freq = 100MHz, slave address = x55 (101_0101)
- (near J4) zlacza ufl oraz sma oraz kable do nich sa 50 ohm Z_se wiec siecezka nie powinna miec 70 ohm Z_se
- (near J4) Ta sama sytuacja co przy liniach diff.
- Project/Equipment
- Document
- uTCA RTM 8 SFP+
- Designer
- Drawn by
- Check.by
- Copyright Creotech Instruments SA 2014.
  This documentation describes Open Hardware and is licensed under the CERN OHL v.1.1. You may redistribute and modify this documentation under the terms of the CERN OHL v.1.1. (http://ohwr.org/CERNOHL). This documentation is distributed WITHOUT ANY EXPRESS OR IMPLIED WARRANTY, INCLUDING OF MERCHANTABILITY, SATISFACTORY QUALITY AND FITNESS FOR A PARTICULAR PURPOSE. Please see the CERN OHL v.1.1 for applicable conditions.
- Creotech Instruments S.A.
- File
- Last Mod.
- Print Date
- Sheet
- Size
- A3
- of
- Rev
- (in symbol R0402_10K_1%_0.0625W_100PPM) 1%
- (in symbol R0402_49R9_1%_0.0625W_100PPM) 1%
- (in symbol R0603_4K3_1%_0.1W_100PPM) 1%

### Library data of the parts
C5 = CC0402_100NF_16V_10%_X7R: as C186 on sheet SFP; Part Number: CC0402_100NF_16V_10%_X7R; Component Kind: Standard; Component Type: Standard; Pin Count: 2; Value: 100nF; Status: Not Recommended; Manufacturer Part Number: CC0402_100NF_16V_10%_X7R; Case: 0402; Mounted: Yes; Socket: No; SMD: Yes; Manufacturer1 Example: PHYCOMP; Manufacturer1 ComponentHeight: 0.55mm; HelpURL: \\cern.ch\dfs\Applications\Altium\Datasheets\CC0402_X7R_PHYCOMP.pdf; Author: CERN DEM JLC; CreateDate: 12/3/2007; LatestRevisionDate: 12/3/2007
C24 C390 = CC0805_10UF_10V_10%_X7R: as C13 on sheet SFP; Part Number: CC0805_10UF_10V_10%_X7R; Component Kind: Standard; Component Type: Standard; Pin Count: 2; Value: 10uF; Status: Preferred; Manufacturer Part Number: CC0805_10UF_10V_10%_X7R; Case: 0805; Mounted: Yes; Socket: No; SMD: Yes; Manufacturer1 Example: MURATA; Manufacturer1 ComponentHeight: 1.35mm; HelpURL: \\cern.ch\dfs\Applications\Altium\Datasheets\CC0805_X7R_MURATA.pdf; Author: CERN DEM JLC; CreateDate: 2012-04-30; LatestRevisionDate: 2012-04-30
C391-C397 C399-C401 = CC0201_100NF_6.3V_10%_X5R: as C402 on sheet I2C_Switch; Part Number: CC0201_100NF_6.3V_10%_X5R; Component Kind: Standard; Component Type: Standard; Pin Count: 2; Value: 100nF; Status: Not Recommended; Manufacturer Part Number: CC0201_100NF_6.3V_10%_X5R; Case: 0201; Mounted: Yes; Socket: No; SMD: Yes; Manufacturer1 Example: AVX; Manufacturer1 ComponentHeight: 0.33mm; HelpURL: \\cern.ch\dfs\Applications\Altium\Datasheets\CC0201_X5R_AVX.pdf; Author: CERN DEM JLC; CreateDate: 2007-12-03; LatestRevisionDate: 2007-12-03
IC11 = CLOCK_CDCLVD1212: Low Jitter, 2-Input Selectable 1:12 Universal-to-LVDS Buffer
J4 = HUBER-SUHNER_85_SMA-50-0-101/111_NE: Part Description: SMA 50 Ohms Right Angle PCB Jack; Manufacturer: HUBER+SUHNER; Table: Miscellaneous; Part Number: HUBER-SUHNER_85_SMA-50-0-101/111_NE; Component Kind: Standard; Component Type: Standard; Pin Count: 2; Family: SMA; Mounted: Yes; Socket: No; SMD: No; Status: None; Manufacturer Part Number: 85_SMA-50-0-101/111_NE; ComponentHeight: 9.6mm; HelpURL: \\cern.ch\dfs\Applications\Altium\Datasheets\HUBER-SUHNER_85 SMA-50-0-101-111 NE.pdf; Author: CERN DEM JLC; CreateDate: 2010-04-20; LatestRevisionDate: 2010-04-27
J12 J13 = HIROSE_U.FL-R-SMT-1(10): Part Description: Up to 6GHz Ultra Small Surface Mount Male Coaxial Connectors U.FL Series; Manufacturer: HIROSE (HRS); Table: Miscellaneous; Part Number: HIROSE_U.FL-R-SMT-1(10); Component Kind: Standard; Component Type: Standard; Pin Count: 2; Family: U.FL; Mounted: Yes; Socket: No; SMD: Yes; Status: None; Manufacturer Part Number: U.FL-R-SMT-1(10); ComponentHeight: 1.25mm; HelpURL: \\cern.ch\dfs\Applications\Altium\Datasheets\HIROSE_U.FL-R-SMT-1(10).pdf; Author: CERN DEM JLC; CreateDate: 2010-03-24; LatestRevisionDate: 2010-03-24
L19 L20 = IND0603_TDK_MPZ1608R391A: Inductor; Part Description: SMT Chip Bead for Power Line; Manufacturer: TDK; Power: 1.2A; Resistance: 0.12R; Tolerance: ±25%; Table: Inductors SMD; Part Number: IND0603_TDK_MPZ1608R391A; Component Kind: Standard; Component Type: Standard; Pin Count: 2; Value: 390R@100MHz; Status: None; Manufacturer Part Number: MPZ1608R391A; Case: 0603; Mounted: Yes; Socket: No; SMD: Yes; ComponentHeight: 0.95mm; HelpURL: \\cern.ch\dfs\Applications\Altium\Datasheets\IND0603_TDK_MPZ1608.pdf; Author: CERN DEM JLC; CreateDate: 2009-12-02; LatestRevisionDate: 2009-12-02
OSC1 = OSC_10-280MHZ_SILICON-LAB_Si570BBC000121DG: Any-Rate I2C Programmable XO Oscillator Si570 Serie; Part Description: 10-280MHz 3.3V ±20ppm LVDS Any-Rate I2C Programmable XO Oscillator Si570 Serie; Manufacturer: SILICON LABS; Value: 100MHz; Table: Crystals & Oscillators; Part Number: OSC_10-280MHZ_SILICON-LAB_Si570BBC000121DG; Component Kind: Standard; Component Type: Standard; PackageDescription: Oscillator Si570 Serie, 8 pins, 5x7mm; Manufacturer Part Number: 570BBC000121DG; Pin Count: 8; Mounted: Yes; Socket: No; SMD: Yes; ComponentHeight: 1.85mm; HelpURL: \\cern.ch\dfs\Applications\Altium\Datasheets\OSC_SILICON-LAB_SI570.pdf; Author: CERN DEM JLC; CreateDate: 2010-02-09; LatestRevisionDate: 2012-03-26
R30 = R0402_10K_1%_0.0625W_100PPM: Resistor - 1%; Part Description: General Purpose Thick Film Chip Resistor; Manufacturer: GENERIC; Manufacturer1 Part Number: 232270671003L; TC: ±100ppm/°C; Mounted: No; Table: Resistors SMD; Part Number: R0402_10K_1%_0.0625W_100PPM; Component Kind: Standard; Component Type: Standard; Pin Count: 2; Value: 10k; Status: Not recommended; Power: 0.0625W; Tolerance: ±1%; Manufacturer Part Number: R0402_10K_1%_0.0625W_100PPM; Case: 0402; Socket: No; SMD: Yes; Manufacturer1 Example: YAGEO PHYCOMP; Manufacturer1 ComponentHeight: 0.4mm; HelpURL: \\cern.ch\dfs\Applications\Altium\Datasheets\R0402_Phycomp_RC0402.pdf; Author: CERN DEM JLC; CreateDate: 2007-12-03; LatestRevisionDate: 2012-10-17
R311 = R0402_10K_1%_0.0625W_100PPM: as R28 on sheet I2C_Switch; Part Number: R0402_10K_1%_0.0625W_100PPM; Component Kind: Standard; Component Type: Standard; Pin Count: 2; Value: 10k; Status: Not recommended; Power: 0.0625W; Tolerance: ±1%; Manufacturer Part Number: R0402_10K_1%_0.0625W_100PPM; Case: 0402; Mounted: Yes; Socket: No; SMD: Yes; Manufacturer1 Example: YAGEO PHYCOMP; Manufacturer1 ComponentHeight: 0.4mm; HelpURL: \\cern.ch\dfs\Applications\Altium\Datasheets\R0402_Phycomp_RC0402.pdf; Author: CERN DEM JLC; CreateDate: 2007-12-03; LatestRevisionDate: 2012-10-17
R312-R315 = R0402_49R9_1%_0.0625W_100PPM: Resistor - 1%; Part Description: General Purpose Thick Film Chip Resistor; Manufacturer: GENERIC; Manufacturer1 Part Number: 232270674999L or RC0402FR-0749R9L; TC: ±100ppm/°C; Table: Resistors SMD; Part Number: R0402_49R9_1%_0.0625W_100PPM; Component Kind: Standard; Component Type: Standard; Pin Count: 2; Value: 49R9; Status: Not recommended; Power: 0.0625W; Tolerance: ±1%; Manufacturer Part Number: R0402_49R9_1%_0.0625W_100PPM; Case: 0402; Mounted: Yes; Socket: No; SMD: Yes; Manufacturer1 Example: YAGEO PHYCOMP; Manufacturer1 ComponentHeight: 0.4mm; HelpURL: \\cern.ch\dfs\Applications\Altium\Datasheets\R0402_Phycomp_RC0402.pdf; Author: CERN DEM JLC; CreateDate: 2012-10-24; LatestRevisionDate: 2012-10-24
R391 = R0603_4K3_1%_0.1W_100PPM: Resistor - 1%; Part Description: General Purpose Thick Film Chip Resistor; Manufacturer: GENERIC; Manufacturer1 Part Number: NRC06F4301TRF; Power: 0.1W; TC: ±100ppm/°C; Table: Resistors SMD; Part Number: R0603_4K3_1%_0.1W_100PPM; Component Kind: Standard; Component Type: Standard; Pin Count: 2; Value: 4k3; Status: Preferred; Tolerance: ±1%; Manufacturer Part Number: R0603_4K3_1%_0.1W_100PPM; Mounted: Yes; Socket: No; SMD: Yes; Manufacturer1 Example: NIC COMPONENT; Manufacturer1 ComponentHeight: 0.55mm; HelpURL: \\cern.ch\dfs\Applications\Altium\Datasheets\R0603_NIC_NRC.pdf; Author: CERN DEM JLC; CreateDate: 2007-12-03; LatestRevisionDate: 2008-03-13